# Altium project Kicker_Altium.PrjPcb
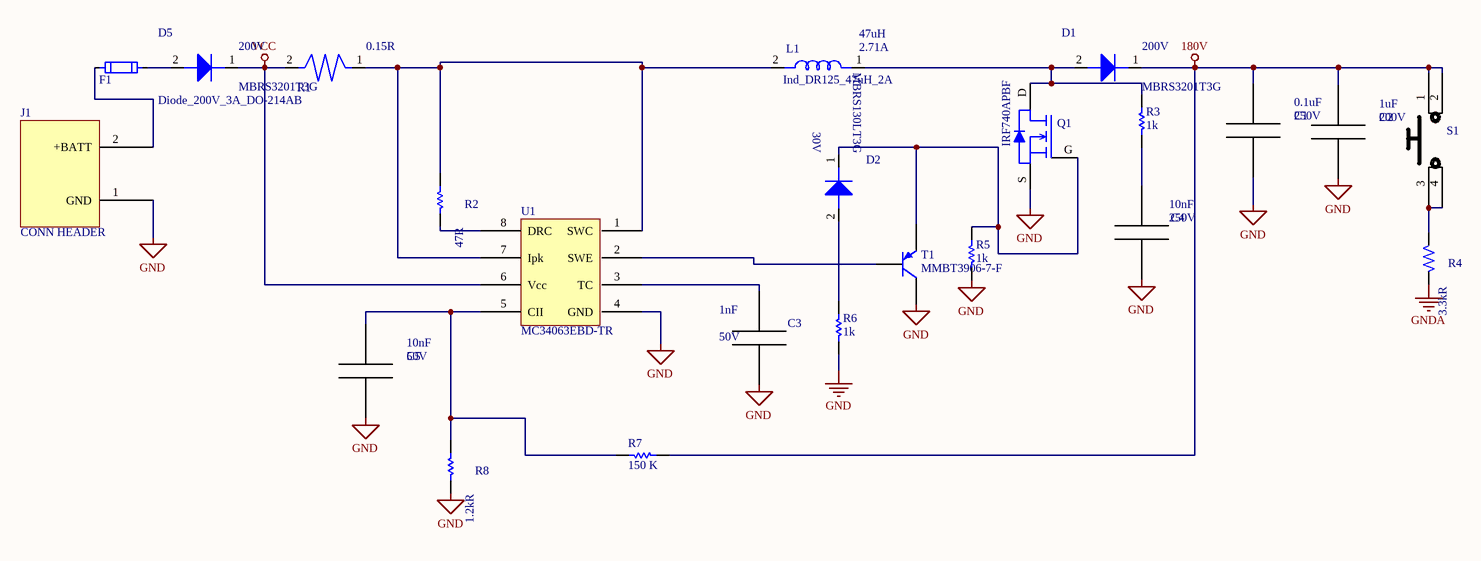
[diagram p0: Sheet2.SchDoc]
1 sheet, 23 parts. Net scope: global (net labels, ports and power ports of the same name join across sheets).
Board file: Kicker.PcbDoc

## Sheet Sheet2.SchDoc
size A4

### Parts
C1  Cap_Cer_0.1u_250V_1206  [CAP_CER_0.1U_250V_1206]  (value not drawn)
C2  Cap_Cer_1u_200V_2225  [Cap_Cer_1u_200V_2225]  (value not drawn)
C3  Cap_Cer_1n_50V_0603  [Cap_Cer 1n_50V_0603]  (value not drawn)
C4  Cap_Cer_10nF_250V_0805  [CAP_CER_10N_250V_0805]  (value not drawn)
C5  Cap_Cer_10n_50V_0603  [Cap_Cer_10n_50V_0603]  (value not drawn)
D1  Diode_200V_3A_DO-214AB  [D320]  (value not drawn)
D2  Diode_30V_2A_DO_214AA  [D130]  (value not drawn)
D5  Diode_200V_3A_DO-214AB  [D320]
F1  Fuseholder(Cartridge)  [FuseHolder]  (value not drawn)
J1  CONN HEADER  [CONN HEADER R_A 2POS 2.54MM]
L1  Ind_DR125_47uH_2A  [DR125]
Q1  IRF740APBF  [To-220]
R1  RES_0.15R_2W_2512  [R2512]  (value not drawn)
R2  Res_47R_0805  [0805]  (value not drawn)
R3  1k  [Resistor_0805]
R4  3.3K OHMS 2512  [RESISTOR_2512]  (value not drawn)
R5  1k  [Resistor_0805]
R6  1k  [Resistor_0805]
R7  150 K  [Resistor_0805]
R8  Res_1.2K_0805_1%  [0805]  (value not drawn)
S1  B3F-1005  [SWITCH_TACTILE_SPST-NO_0.05A_24V]  (value not drawn)
T1  MMBT3906-7-F  [SOT-23-3]
U1  MC34063EBD-TR  [MC34063EBD-TR]

### Nets
180V: C1.1 C2.1 D1.1 R7.1 S1.1 S1.2
GND: C1.2 C2.2 C3.2 C4.2 C5.2 J1.1(GND) Q1.S R5.1 R6.1 R8.1 T1.C U1.4(GND)
GNDA: R4.2
VCC: D5.1 R1.2 U1.6(Vcc)
NetC3_1: C3.1 U1.3(TC)
NetC4_1: C4.1 R3.1
NetC5_1: C5.1 R7.2 R8.2 U1.5(CII)
NetD1_2: D1.2 L1.1 Q1.D R3.2
NetD2_1: D2.1 Q1.G R5.2 T1.E
NetD2_2: D2.2 R6.2
NetD5_2: D5.2 F1.1
NetF1_2: F1.2 J1.2(+BATT)
NetL1_2: L1.2 R1.1 R2.2 U1.1(SWC) U1.7(Ipk)
NetR2_1: R2.1 U1.8(DRC)
NetR4_1: R4.1 S1.3 S1.4
NetT1_B: T1.B U1.2(SWE)

### Notes on the sheet
- (in symbol Cap_Cer_0.1u_250V_1206) 0.1uF
- (in symbol RES_0.15R_2W_2512) 0.15R

### Library data of the parts
C1 = Cap_Cer_0.1u_250V_1206: KEMET - C1206C104KARACTU - CAP, 0.1µF, 250V, 10%, X7R, 1206; Dielectric Material: Ceramic; Capacitance: 100nF; Dissipation Factor: 2.5%; Supplier 1: Digi-Key; Manufacturer: KEMET; Manufacturer Part Number: C1206C104KARACTU; RoHS: Yes; Category: Ceramic Capacitors; Stock 1: 71903; Pricing 1: 1=0,40000, 10=0,27700, 100=0,16620, 500=0,12466, 1000=0,10527 (USD); Mount: Surface Mount,PCB; Case/Package: 1206; Number of Pins: 2; Case Code (Metric): 3216; Case Code (Imperial): 1206; Contact Plating: Tin,Matte; Min Operating Temperature: -55°C; Max Operating Temperature: 125°C; Package Quantity: 2500; Voltage Rating: 250V; Tolerance: 10%; Packaging: Tape and Reel; Voltage Rating (DC): 250V; Dielectric: X7R; Termination: SMD/SMT; Voltage: 250V; Length: 3.2mm; Height: 1.25mm; Width: 0.063inch; Thickness: 0.055inch; Depth: 1.6mm; Radiation Hardening: No; REACH SVHC: No SVHC; ComponentLink1URL: https://datasheet.ciiva.com/146/kem-c1002-x7r-smd-146896.pdf?src-supplier=Digi-Key; ComponentLink1Description: https://datasheet.ciiva.com/146/kem-c1002-x7r-smd-146896.pdf?src-supplier=Digi-Key; ComponentLink2URL: https://datasheet.ciiva.com/146/kem-c1002-x7r-smd-146897.pdf?src-supplier=Digi-Key; ComponentLink2Description: https://datasheet.ciiva.com/146/kem-c1002-x7r-smd-146897.pdf?src-supplier=Digi-Key; ComponentLink3URL: https://datasheet.ciiva.com/146/kem-c1002-x7r-smd-146898.pdf?src-supplier=Digi-Key; ComponentLink3Description: https://datasheet.ciiva.com/146/kem-c1002-x7r-smd-146898.pdf?src-supplier=Digi-Key; ComponentLink4URL: https://datasheet.ciiva.com/28533/1918693-28533237.pdf?src-supplier=Element14; ComponentLink4Description: https://datasheet.ciiva.com/28533/1918693-28533237.pdf?src-supplier=Element14; ComponentLink5URL: https://datasheet.ciiva.com/14588/70096117-14588278.pdf?src-supplier=Allied+Electronics; ComponentLink5Description: https://datasheet.ciiva.com/14588/70096117-14588278.pdf?src-supplier=Allied+Electronics; ComponentLink6URL: https://datasheet.ciiva.com/6094/kem-c1002-x7r-smd-6094138.pdf?src-supplier=Farnell; ComponentLink6Description: https://datasheet.ciiva.com/6094/kem-c1002-x7r-smd-6094138.pdf?src-supplier=Farnell
C2 = Cap_Cer_1u_200V_2225: CAP CER 1UF 200V X7R 2225; Manufacturer: Vishay Vitramon; Manufacturer Part Number: VJ2225Y105KXCAT; Tolerance: 10%; Supplier 1: Digi-Key; RoHS: Yes; Category: Ceramic Capacitors; Stock 1: 12164; Pricing 1: 1=2,15000, 10=1,74000, 100=1,32860 (USD); Mount: Surface Mount; Case/Package: 2225; Case Code (Metric): 5763; Case Code (Imperial): 2225; Min Operating Temperature: -55°C; Max Operating Temperature: 125°C; Capacitance: 1uF; Voltage Rating (DC): 200V; Dielectric: X7R; Packaging: Tape and Reel; Termination: SMD/SMT; Package Quantity: 1; Voltage Rating: 200V; Length: 5.59mm; Height: 2.18mm; Width: 0.25inch; Thickness: 0.086inch; Depth: 6.35mm; Radiation Hardening: No; Lead Free: Lead Free; ComponentLink1URL: https://datasheet.ciiva.com/149/vjcommercialseries-149648.pdf?src-supplier=Digi-Key; ComponentLink1Description: https://datasheet.ciiva.com/149/vjcommercialseries-149648.pdf?src-supplier=Digi-Key; ComponentLink2URL: https://datasheet.ciiva.com/149/vjcommercialseries-149649.pdf?src-supplier=Digi-Key; ComponentLink2Description: https://datasheet.ciiva.com/149/vjcommercialseries-149649.pdf?src-supplier=Digi-Key; ComponentLink3URL: https://datasheet.ciiva.com/15165/getdatasheetpartid-44670-15165222.pdf?src-supplier=Verical; ComponentLink3Description: https://datasheet.ciiva.com/15165/getdatasheetpartid-44670-15165222.pdf?src-supplier=Verical; ComponentLink4URL: https://datasheet.ciiva.com/149/vjcommercialseries-149647.pdf?src-supplier=Digi-Key; ComponentLink4Description: https://datasheet.ciiva.com/149/vjcommercialseries-149647.pdf?src-supplier=Digi-Key
C3 = Cap_Cer_1n_50V_0603: MURATA - GRM188R71H102KA01D - CAP, MLCC, X7R, 1NF, 50V, 0603, REEL; Dielectric Material: Ceramic; Tolerance: 10%; Insulation Resistance: 10GR; Supplier 1: Future Electronics; Manufacturer: Murata; Manufacturer Part Number: GRM188R71H102KA01D; RoHS: Yes; Category: Ceramic Capacitors; Stock 1: 2496000; Pricing 1: 4000=0,00310 (USD); Mount: Surface Mount; Case/Package: 0603; Number of Pins: 2; Material: Ceramic; Case Code (Metric): 1608; Case Code (Imperial): 0603; Min Operating Temperature: -55°C; Max Operating Temperature: 125°C; Dielectric: X7R; Capacitance: 1nF; Voltage Rating (DC): 50V; Packaging: Tape and Reel; Package Quantity: 1; Termination: SMD/SMT; Voltage: 50V; Voltage Rating: 50V; Length: 1.6mm; Height: 0.8mm; Width: 0.031inch; Thickness: 0.035inch; Depth: 0.8mm; REACH SVHC: No SVHC; Lead Free: Lead Free; ComponentLink1URL: https://datasheet.ciiva.com/19476/1857575-19476358.pdf?src-supplier=Jameco; ComponentLink1Description: https://datasheet.ciiva.com/19476/1857575-19476358.pdf?src-supplier=Jameco; ComponentLink2URL: https://datasheet.ciiva.com/29202/451684-da-01-en-vs-kondensator-0603-29202035.pdf?src-supplier=Conrad; ComponentLink2Description: https://datasheet.ciiva.com/29202/451684-da-01-en-vs-kondensator-0603-29202035.pdf?src-supplier=Conrad; ComponentLink3URL: https://datasheet.ciiva.com/14116/grmseries-highdielectrictype-eng-14116630.pdf?src-supplier=Distrelec; ComponentLink3Description: https://datasheet.ciiva.com/14116/grmseries-highdielectrictype-eng-14116630.pdf?src-supplier=Distrelec; ComponentLink4URL: https://datasheet.ciiva.com/16311/product-16311526.pdf?src-supplier=Future+Electronics; ComponentLink4Description: https://datasheet.ciiva.com/16311/product-16311526.pdf?src-supplier=Future+Electronics; ComponentLink5URL: https://datasheet.ciiva.com/129/partnumbering-e-01-129816.pdf?src-supplier=Digi-Key; ComponentLink5Description: https://datasheet.ciiva.com/129/partnumbering-e-01-129816.pdf?src-supplier=Digi-Key; ComponentLink6URL: https://datasheet.ciiva.com/129/partnumbering-e-01-129817.pdf?src-supplier=Digi-Key; ComponentLink6Description: https://datasheet.ciiva.com/129/partnumbering-e-01-129817.pdf?src-supplier=Digi-Key; ComponentLink7URL: https://datasheet.ciiva.com/129/partnumbering-e-01-129818.pdf?src-supplier=Digi-Key; ComponentLink7Description: https://datasheet.ciiva.com/129/partnumbering-e-01-129818.pdf?src-supplier=Digi-Key; ComponentLink8URL: https://datasheet.ciiva.com/5424/product-5424794.pdf?src-supplier=Mouser; ComponentLink8Description: https://datasheet.ciiva.com/5424/product-5424794.pdf?src-supplier=Mouser; ComponentLink9URL: https://datasheet.ciiva.com/28534/1769893-28534220.pdf?src-supplier=Element14; ComponentLink9Description: https://datasheet.ciiva.com/28534/1769893-28534220.pdf?src-supplier=Element14; ComponentLink10URL: https://datasheet.ciiva.com/46441/4360-46441324.pdf?src-supplier=Element14; ComponentLink10Description: https://datasheet.ciiva.com/46441/4360-46441324.pdf?src-supplier=Element14; ComponentLink11URL: https://datasheet.ciiva.com/48428/nmgrm-data-en-48428588.pdf?src-supplier=Distrelec; ComponentLink11Description: https://datasheet.ciiva.com/48428/nmgrm-data-en-48428588.pdf?src-supplier=Distrelec; ComponentLink12URL: https://datasheet.ciiva.com/7937/1784410-7937653.pdf?src-supplier=Element14; ComponentLink12Description: https://datasheet.ciiva.com/7937/1784410-7937653.pdf?src-supplier=Element14; ComponentLink13URL: https://datasheet.ciiva.com/48428/nmgrm-data-en-48428589.pdf?src-supplier=Distrelec; ComponentLink13Description: https://datasheet.ciiva.com/48428/nmgrm-data-en-48428589.pdf?src-supplier=Distrelec
C4 = Cap_Cer_10nF_250V_0805: Capacitors; Ceramic SMT; Tip and Ring; .010uF 250V; 10%; X7R; TR; Manufacturer: KEMET; Manufacturer Part Number: C0805C103KARACTU; Capacitance: 10nF; Supplier 1: Digi-Key; RoHS: Yes; Category: Ceramic Capacitors; Stock 1: 136764; Pricing 1: 1=0,20000, 10=0,13900, 100=0,07020, 500=0,04802, 1000=0,04248 (USD); Mount: Surface Mount,PCB; Case/Package: 0805; Number of Pins: 2; Case Code (Metric): 2012; Case Code (Imperial): 0805; Contact Plating: Tin,Matte; Dielectric Material: Ceramic; Min Operating Temperature: -55°C; Max Operating Temperature: 125°C; Tolerance: 10%; Package Quantity: 1; Voltage Rating: 250V; Packaging: Tape and Reel; Voltage Rating (DC): 250V; Dielectric: X7R; Termination: SMD/SMT; Voltage: 250V; Dissipation Factor: 10%; Length: 2mm; Height: 0.78mm; Width: 0.049inch; Thickness: 0.035inch; Lead Pitch: 0.75mm; Depth: 1.2mm; Radiation Hardening: No; REACH SVHC: No SVHC; ComponentLink1URL: https://datasheet.ciiva.com/26923/getdatasheetpartid-151914-26923959.pdf?src-supplier=Verical; ComponentLink1Description: https://datasheet.ciiva.com/26923/getdatasheetpartid-151914-26923959.pdf?src-supplier=Verical; ComponentLink2URL: https://datasheet.ciiva.com/145/kem-c1002-x7r-smd-145393.pdf?src-supplier=Digi-Key; ComponentLink2Description: https://datasheet.ciiva.com/145/kem-c1002-x7r-smd-145393.pdf?src-supplier=Digi-Key; ComponentLink3URL: https://datasheet.ciiva.com/145/kem-c1002-x7r-smd-145394.pdf?src-supplier=Digi-Key; ComponentLink3Description: https://datasheet.ciiva.com/145/kem-c1002-x7r-smd-145394.pdf?src-supplier=Digi-Key; ComponentLink4URL: https://datasheet.ciiva.com/145/kem-c1002-x7r-smd-145395.pdf?src-supplier=Digi-Key; ComponentLink4Description: https://datasheet.ciiva.com/145/kem-c1002-x7r-smd-145395.pdf?src-supplier=Digi-Key; ComponentLink5URL: https://datasheet.ciiva.com/22700/1851736-22700520.pdf?src-supplier=Element14; ComponentLink5Description: https://datasheet.ciiva.com/22700/1851736-22700520.pdf?src-supplier=Element14
C5 = Cap_Cer_10n_50V_0603: Capacitor 10 nF 50 VDC 0603 | Murata GRM188R71H103KA01D (Capacitor 10 nF 50 VDC 0603 Ceramic Capacitors).; Capacitance: 10nF; Tolerance: 10%; Dielectric: X7R; Voltage: 50V; Insulation Resistance: 10GR; Supplier 1: Arrow; Manufacturer: Murata; Manufacturer Part Number: GRM188R71H103KA01D; RoHS: Yes; Category: Ceramic Capacitors; Stock 1: 472000; Pricing 1: 4000=0,01810, 8000=0,01790, 24000=0,01540, 100000=0,01510 (USD); Mount: Surface Mount; Case/Package: 0603; Number of Pins: 2; Material: Ceramic; Case Code (Metric): 1608; Case Code (Imperial): 0603; Dielectric Material: Ceramic; Min Operating Temperature: -55°C; Max Operating Temperature: 125°C; Termination: SMD/SMT; Package Quantity: 1; Voltage Rating: 50V; Packaging: Tape and Reel; Voltage Rating (DC): 50V; Length: 1.6mm; Height: 0.8mm; Thickness: 0.035inch; Depth: 0.8mm; Width: 0.031inch; Lead Free: Lead Free; REACH SVHC: Unknown; ComponentLink1URL: https://datasheet.ciiva.com/129/product-129872.pdf?src-supplier=Digi-Key; ComponentLink1Description: https://datasheet.ciiva.com/129/product-129872.pdf?src-supplier=Digi-Key; ComponentLink2URL: https://datasheet.ciiva.com/11786/0900766b8003061f-11786516.pdf?src-supplier=RSComponents; ComponentLink2Description: https://datasheet.ciiva.com/11786/0900766b8003061f-11786516.pdf?src-supplier=RSComponents; ComponentLink3URL: https://datasheet.ciiva.com/29202/451715-da-01-en-vs-kondensator-0603-29202047.pdf?src-supplier=Conrad; ComponentLink3Description: https://datasheet.ciiva.com/29202/451715-da-01-en-vs-kondensator-0603-29202047.pdf?src-supplier=Conrad; ComponentLink4URL: https://datasheet.ciiva.com/129/partnumbering-e-01-129870.pdf?src-supplier=Digi-Key; ComponentLink4Description: https://datasheet.ciiva.com/129/partnumbering-e-01-129870.pdf?src-supplier=Digi-Key; ComponentLink5URL: https://datasheet.ciiva.com/48428/nmgrm-data-en-48428590.pdf?src-supplier=Distrelec; ComponentLink5Description: https://datasheet.ciiva.com/48428/nmgrm-data-en-48428590.pdf?src-supplier=Distrelec; ComponentLink6URL: https://datasheet.ciiva.com/129/partnumbering-e-01-129871.pdf?src-supplier=Digi-Key; ComponentLink6Description: https://datasheet.ciiva.com/129/partnumbering-e-01-129871.pdf?src-supplier=Digi-Key; ComponentLink7URL: https://datasheet.ciiva.com/48428/nmgrm-data-en-48428591.pdf?src-supplier=Distrelec; ComponentLink7Description: https://datasheet.ciiva.com/48428/nmgrm-data-en-48428591.pdf?src-supplier=Distrelec; ComponentLink8URL: https://datasheet.ciiva.com/7937/4360-7937654.pdf?src-supplier=Element14; ComponentLink8Description: https://datasheet.ciiva.com/7937/4360-7937654.pdf?src-supplier=Element14; ComponentLink9URL: https://datasheet.ciiva.com/7937/1747461-7937655.pdf?src-supplier=Element14; ComponentLink9Description: https://datasheet.ciiva.com/7937/1747461-7937655.pdf?src-supplier=Element14; ComponentLink10URL: https://datasheet.ciiva.com/7937/1747461-7937656.pdf?src-supplier=Element14; ComponentLink10Description: https://datasheet.ciiva.com/7937/1747461-7937656.pdf?src-supplier=Element14; ComponentLink11URL: https://datasheet.ciiva.com/28534/1769893-28534235.pdf?src-supplier=Element14; ComponentLink11Description: https://datasheet.ciiva.com/28534/1769893-28534235.pdf?src-supplier=Element14
D1 D5 = Diode_200V_3A_DO-214AB: ON SEMICONDUCTOR - MBRS3201T3G - Schottky Rectifier, 200 V, 3 A, Single, DO-214AB (SMC), 2 Pins, 840 mV; Peak Reverse Current: 5uA; Max Surge Current: 100A; Forward Voltage: 840mV; Forward Current: 3A; Recovery Time: 35ns; Max Repetitive Reverse Voltage (Vrrm): 200V; Polarity: Standard; Supplier 1: Digi-Key; Manufacturer: ON Semiconductor; Manufacturer Part Number: MBRS3201T3G; RoHS: Yes; Category: Schottky Diodes; Stock 1: 6509; Pricing 1: 1=0,60000, 10=0,53200, 25=0,49960, 100=0,36270, 250=0,34980, 500=0,30306, 1000=0,25792 (USD); Case/Package: SMC; Number of Pins: 2; Contact Plating: Tin,Matte; Min Operating Temperature: -55°C; Max Operating Temperature: 150°C; Package Quantity: 2500; Packaging: Tape and Reel; Average Rectified Current: 3A; Reverse Recovery Time: 35ns; Max Reverse Leakage Current: 5uA; Peak Non-Repetitive Surge Current: 100A; Max Forward Surge Current (Ifsm): 100A; Element Configuration: Single; Voltage Rating (DC): 200V; Current Rating: 3A; Output Current: 3A; Max Reverse Voltage (DC): 200V; Length: 7.11mm; Height: 2.26mm; Width: 6.1mm; Radiation Hardening: No; REACH SVHC: No SVHC; Lead Free: Lead Free; Halogen Free: Halogen Free; ComponentLink1URL: https://datasheet.ciiva.com/923/mbrs3201t3-d-923290.pdf?src-supplier=Avnet; ComponentLink1Description: https://datasheet.ciiva.com/923/mbrs3201t3-d-923290.pdf?src-supplier=Avnet; ComponentLink2URL: https://datasheet.ciiva.com/22659/1708281-22659072.pdf?src-supplier=Element14; ComponentLink2Description: https://datasheet.ciiva.com/22659/1708281-22659072.pdf?src-supplier=Element14; ComponentLink3URL: https://datasheet.ciiva.com/916/mbrs3201t3-916256.pdf?src-supplier=Digi-Key; ComponentLink3Description: https://datasheet.ciiva.com/916/mbrs3201t3-916256.pdf?src-supplier=Digi-Key; ComponentLink4URL: https://datasheet.ciiva.com/26912/getdatasheetpartid-105192-26912741.pdf?src-supplier=Verical; ComponentLink4Description: https://datasheet.ciiva.com/26912/getdatasheetpartid-105192-26912741.pdf?src-supplier=Verical; ComponentLink5URL: https://datasheet.ciiva.com/25948/mbrs3201t3-d-25948165.pdf?src-supplier=Avnet+Europe; ComponentLink5Description: https://datasheet.ciiva.com/25948/mbrs3201t3-d-25948165.pdf?src-supplier=Avnet+Europe; ComponentLink6URL: https://datasheet.ciiva.com/8294/mbrs3201t3-d-8294973.pdf?src-supplier=Avnet; ComponentLink6Description: https://datasheet.ciiva.com/8294/mbrs3201t3-d-8294973.pdf?src-supplier=Avnet; ComponentLink7URL: https://datasheet.ciiva.com/916/mbrs3201t3-d-916255.pdf?src-supplier=Digi-Key; ComponentLink7Description: https://datasheet.ciiva.com/916/mbrs3201t3-d-916255.pdf?src-supplier=Digi-Key; ComponentLink8URL: https://datasheet.ciiva.com/916/mbrs3201t3-d-916257.pdf?src-supplier=Digi-Key; ComponentLink8Description: https://datasheet.ciiva.com/916/mbrs3201t3-d-916257.pdf?src-supplier=Digi-Key; ComponentLink9URL: https://datasheet.ciiva.com/16393/mbrs3201t3-d-16393647.pdf?src-supplier=Future+Electronics; ComponentLink9Description: https://datasheet.ciiva.com/16393/mbrs3201t3-d-16393647.pdf?src-supplier=Future+Electronics; Supplier Part Number 1: MBRS3201T3GOSCT-ND
D2 = Diode_30V_2A_DO_214AA: ON SEMICONDUCTOR - MBRS130LT3G - Rectifier Diode, Single, 30 V, 2 A, DO-214AA, 2, 395 mV RoHS Compliant: Yes; Max Surge Current: 40A; Forward Voltage: 395mV; Forward Current: 2A; Peak Reverse Current: 1mA; Max Repetitive Reverse Voltage (Vrrm): 30V; Polarity: Standard; Current Rating: 1A; Manufacturer: ON Semiconductor; Manufacturer Part Number: MBRS130LT3G; RoHS: Yes; Pricing 1: 1=0,47000, 10=0,34900, 25=0,30520, 100=0,16570, 250=0,16480, 500=0,13516, 1000=0,10028 (USD); Case/Package: SMB; Number of Pins: 2; Contact Plating: Tin,Matte; Min Operating Temperature: -65°C; Max Operating Temperature: 125°C; Package Quantity: 1; Packaging: Tape and Reel; Average Rectified Current: 2A; Max Reverse Leakage Current: 1mA; Max Forward Surge Current (Ifsm): 40A; Termination: SMD/SMT; Peak Non-Repetitive Surge Current: 40A; Element Configuration: Single; Voltage Rating (DC): 30V; Output Current: 1A; Max Reverse Voltage (DC): 30V; Length: 0.181inch; Height: 0.09inch; Width: 0.156inch; Radiation Hardening: No; REACH SVHC: No SVHC; Lead Free: Lead Free; Halogen Free: Halogen Free; ComponentLink1URL: https://datasheet.ciiva.com/5763/mbrs130lt3-d-5763008.pdf?src-supplier=Farnell; ComponentLink1Description: https://datasheet.ciiva.com/5763/mbrs130lt3-d-5763008.pdf?src-supplier=Farnell; ComponentLink2URL: https://datasheet.ciiva.com/915/mbrs130lt3-d-915698.pdf?src-supplier=Digi-Key; ComponentLink2Description: https://datasheet.ciiva.com/915/mbrs130lt3-d-915698.pdf?src-supplier=Digi-Key; ComponentLink3URL: https://datasheet.ciiva.com/27050/865899-27050530.pdf?src-supplier=Jameco; ComponentLink3Description: https://datasheet.ciiva.com/27050/865899-27050530.pdf?src-supplier=Jameco; ComponentLink4URL: https://datasheet.ciiva.com/22659/1708275-22659062.pdf?src-supplier=Element14; ComponentLink4Description: https://datasheet.ciiva.com/22659/1708275-22659062.pdf?src-supplier=Element14; ComponentLink5URL: https://datasheet.ciiva.com/915/mbrs130lt3-d-915699.pdf?src-supplier=Digi-Key; ComponentLink5Description: https://datasheet.ciiva.com/915/mbrs130lt3-d-915699.pdf?src-supplier=Digi-Key; ComponentLink6URL: https://datasheet.ciiva.com/915/mbrs130lt3-d-915700.pdf?src-supplier=Digi-Key; ComponentLink6Description: https://datasheet.ciiva.com/915/mbrs130lt3-d-915700.pdf?src-supplier=Digi-Key; ComponentLink7URL: https://datasheet.ciiva.com/7962/mbrs130lt3-d-7962810.pdf?src-supplier=Element14; ComponentLink7Description: https://datasheet.ciiva.com/7962/mbrs130lt3-d-7962810.pdf?src-supplier=Element14; ComponentLink8URL: https://datasheet.ciiva.com/25950/mbrs130lt3-d-25950250.pdf?src-supplier=Avnet+Europe; ComponentLink8Description: https://datasheet.ciiva.com/25950/mbrs130lt3-d-25950250.pdf?src-supplier=Avnet+Europe; ComponentLink9URL: https://datasheet.ciiva.com/16363/mbrs130lt3-d-16363355.pdf?src-supplier=Future+Electronics; ComponentLink9Description: https://datasheet.ciiva.com/16363/mbrs130lt3-d-16363355.pdf?src-supplier=Future+Electronics; Supplier 1: Digi-Key; Category: Schottky Diodes; Supplier Part Number 1: MBRS130LT3GOSCT-ND
F1 = Fuseholder(Cartridge): Fuse Holder 10A 500VDC Solder Pin Through Hole Bulk Cartridge; Manufacturer: Schurter; Manufacturer Part Number: 00318201; Body Material: Thermoplastic; Material: Thermoplastic,Tin; Color: Black; Illumination Type: Illuminated; Number of Circuits: 1; Voltage: 500V; Insulation Resistance: 10MR; Voltage Rating: 250V; Approvals: UL,CSA,IEC,EN; Supplier 1: Digi-Key; RoHS: Yes; Category: Fuses; Stock 1: 26932; Pricing 1: 1=0,91000, 50=0,67600, 100=0,60800, 500=0,45900, 1000=0,34080 (USD); Mount: PCB,Through Hole; Weight: 0.059966oz; Contact Plating: Tin; Contact Material: Copper Alloy,Tin; Min Operating Temperature: -40°C; Max Operating Temperature: 85°C; Packaging: Bulk; Orientation: Horizontal; Termination: PC Pin; Fuse Current: 10A; Current Rating: 10A; Number of Poles: 1; Package Quantity: 100; Voltage Rating (DC): 500V; Voltage Rating (AC): 500V; Length: 25mm; Depth: 10.8mm; Radiation Hardening: No; Lead Free: Lead Free; REACH SVHC: No SVHC; Flammability Rating: UL94 V-0; ComponentLink1URL: https://datasheet.ciiva.com/3014/typ-ogn-3014480.pdf?src-supplier=Avnet; ComponentLink1Description: https://datasheet.ciiva.com/3014/typ-ogn-3014480.pdf?src-supplier=Avnet; ComponentLink2URL: https://datasheet.ciiva.com/3014/typ-ogn-3014480.pdf?src-supplier=Mouser; ComponentLink2Description: https://datasheet.ciiva.com/3014/typ-ogn-3014480.pdf?src-supplier=Mouser; ComponentLink3URL: https://datasheet.ciiva.com/16215/typ-ogn-16215099.pdf?src-supplier=Onlinecomponents.com; ComponentLink3Description: https://datasheet.ciiva.com/16215/typ-ogn-16215099.pdf?src-supplier=Onlinecomponents.com; ComponentLink4URL: https://datasheet.ciiva.com/1269/1842496-1269251.pdf?src-supplier=Element14; ComponentLink4Description: https://datasheet.ciiva.com/1269/1842496-1269251.pdf?src-supplier=Element14; ComponentLink5URL: https://datasheet.ciiva.com/16203/typ-ogn-16203626.pdf?src-supplier=Future+Electronics; ComponentLink5Description: https://datasheet.ciiva.com/16203/typ-ogn-16203626.pdf?src-supplier=Future+Electronics; ComponentLink6URL: https://datasheet.ciiva.com/16463/typ-ogn-16463850.pdf?src-supplier=Avnet+Asia; ComponentLink6Description: https://datasheet.ciiva.com/16463/typ-ogn-16463850.pdf?src-supplier=Avnet+Asia; ComponentLink7URL: https://datasheet.ciiva.com/25893/typ-ogn-25893934.pdf?src-supplier=Avnet+Europe; ComponentLink7Description: https://datasheet.ciiva.com/25893/typ-ogn-25893934.pdf?src-supplier=Avnet+Europe; ComponentLink8URL: https://datasheet.ciiva.com/15188/getdatasheetpartid-392104-15188042.pdf?src-supplier=Verical; ComponentLink8Description: https://datasheet.ciiva.com/15188/getdatasheetpartid-392104-15188042.pdf?src-supplier=Verical
J1 = CONN HEADER R_A 2POS 2.54MM: Conn Wire to Board HDR 2 POS 2.54mm Solder RA Thru-Hole Bag; Manufacturer 1: Molex; Gender: Male; Number of Circuits: 2; Contact Resistance: 10mR; Max Current Rating: 4A; Max Voltage Rating (AC): 250V; Glow Wire Compliant: Non-compliant; Approvals: UL,CSA; Supplier 1: Digi-Key; Manufacturer Part Number 1: 22-05-3021; Stock 1: 15372; Pricing 1: 1=0,34000, 10=0,31700, 100=0,22200, 500=0,19026, 1000=0,15855, 5000=0,13590, 10000=0,12684 (USD); RoHS: Yes; Mount: Through Hole; Housing Color: White; Housing Material: Nylon; Contact Material: Brass; Contact Plating: Tin,Copper; Color: White; Min Operating Temperature: 0°C; Max Operating Temperature: 75°C; Orientation: Right Angle; Number of Positions: 2; Termination: Through Hole; Number of Rows: 1; Number of Contacts: 2; Voltage Rating: 250V; Current Rating: 4A; Packaging: Bulk; Package Quantity: 3000; Length: 5.08mm; Height: 6.35mm; Pitch: 2.54mm; Depth: 12.83mm; Radiation Hardening: No; REACH SVHC: Unknown; Halogen Free: Low Halogen; Lead Free: Lead Free; Flammability Rating: UL94 V-0; ComponentLink1URL: https://datasheet.ciiva.com/30078/51220022053021-pcb-headers-30078128.pdf?src-supplier=Onlinecomponents.com; ComponentLink1Description: https://datasheet.ciiva.com/30078/51220022053021-pcb-headers-30078128.pdf?src-supplier=Onlinecomponents.com; ComponentLink2URL: https://datasheet.ciiva.com/15217/getdatasheetpartid-149585-15217569.pdf?src-supplier=Verical; ComponentLink2Description: https://datasheet.ciiva.com/15217/getdatasheetpartid-149585-15217569.pdf?src-supplier=Verical; ComponentLink3URL: https://datasheet.ciiva.com/11746/0900766b80d8f337-11746227.pdf?src-supplier=RSComponents; ComponentLink3Description: https://datasheet.ciiva.com/11746/0900766b80d8f337-11746227.pdf?src-supplier=RSComponents; ComponentLink4URL: https://datasheet.ciiva.com/19461/1965824-19461009.pdf?src-supplier=Jameco; ComponentLink4Description: https://datasheet.ciiva.com/19461/1965824-19461009.pdf?src-supplier=Jameco; ComponentLink5URL: https://datasheet.ciiva.com/5158/0022053021-pcb-headers-158630-5158265.pdf?src-supplier=Mouser; ComponentLink5Description: https://datasheet.ciiva.com/5158/0022053021-pcb-headers-158630-5158265.pdf?src-supplier=Mouser; ComponentLink6URL: https://datasheet.ciiva.com/19460/233437-19460906.pdf?src-supplier=Jameco; ComponentLink6Description: https://datasheet.ciiva.com/19460/233437-19460906.pdf?src-supplier=Jameco; ComponentLink7URL: https://datasheet.ciiva.com/7920/1631484-7920683.pdf?src-supplier=Element14; ComponentLink7Description: https://datasheet.ciiva.com/7920/1631484-7920683.pdf?src-supplier=Element14; ComponentLink8URL: https://datasheet.ciiva.com/16725/0022053021-pcb-headers-16725597.pdf?src-supplier=Avnet+Europe; ComponentLink8Description: https://datasheet.ciiva.com/16725/0022053021-pcb-headers-16725597.pdf?src-supplier=Avnet+Europe; ComponentLink9URL: https://datasheet.ciiva.com/9468/0022053021-pcb-headers-9468406.pdf?src-supplier=Avnet; ComponentLink9Description: https://datasheet.ciiva.com/9468/0022053021-pcb-headers-9468406.pdf?src-supplier=Avnet; Supplier Part Number 1: 900-0022053021-ND
L1 = Ind_DR125_47uH_2A: FIXED IND 47UH 2.71A 74 MOHM SMD; Manufacturer: Eaton Cooper; Manufacturer Part Number: DR125-470-R; Core Material: Ferrite; Tolerance: 20%; Shielding: Shielded; Saturation Current: 3.24A; DC Resistance (DCR): 74mR; Test Frequency: 100kHz; Supplier 1: Digi-Key; RoHS: Yes; Category: Fixed Inductors; Stock 1: 13528; Pricing 1: 1=1,54000, 10=1,43200, 100=1,03530 (USD); Mount: Surface Mount; Case/Package: Nonstandard; Number of Pins: 2; Weight: 0.144oz; Min Operating Temperature: -40°C; Max Operating Temperature: 125°C; Packaging: Tape and Reel; Inductance Tolerance: 20%; Inductance: 47uH; Current Rating: 2.71A; Max DC Current: 2.71A; Termination: SMD/SMT; Composition: Wirewound; DC Current: 2.71A; Military Standard: Not; Self Resonant Frequency: 100kHz; RMS Current (Irms): 2.71A; Length: 12.5mm; Height: 6mm; Width: 12.5mm; Height - Seated (Max): 0.236inch; Depth: 12.5mm; Radiation Hardening: No; REACH SVHC: No SVHC; ComponentLink1URL: https://datasheet.ciiva.com/14667/0900766b8116a153-14667792.pdf?src-supplier=RSComponents; ComponentLink1Description: https://datasheet.ciiva.com/14667/0900766b8116a153-14667792.pdf?src-supplier=RSComponents; ComponentLink2URL: https://datasheet.ciiva.com/26858/getdatasheetpartid-246997-26858394.pdf?src-supplier=Verical; ComponentLink2Description: https://datasheet.ciiva.com/26858/getdatasheetpartid-246997-26858394.pdf?src-supplier=Verical; ComponentLink3URL: https://datasheet.ciiva.com/16941/70037876-16941158.pdf?src-supplier=Allied+Electronics; ComponentLink3Description: https://datasheet.ciiva.com/16941/70037876-16941158.pdf?src-supplier=Allied+Electronics; ComponentLink4URL: https://datasheet.ciiva.com/30119/43bus-elx-ds-4315-dr-ser-30119639.pdf?src-supplier=Onlinecomponents.com; ComponentLink4Description: https://datasheet.ciiva.com/30119/43bus-elx-ds-4315-dr-ser-30119639.pdf?src-supplier=Onlinecomponents.com; ComponentLink5URL: https://datasheet.ciiva.com/27053/1771683-27053547.pdf?src-supplier=Jameco; ComponentLink5Description: https://datasheet.ciiva.com/27053/1771683-27053547.pdf?src-supplier=Jameco; Supplier Part Number 1: 513-1128-1-ND
Q1 = IRF740APBF: MOSFET, N, 400V, 10A, TO-220; Transistor Polarity:N Channel; Continuous Drain Current Id:10A; Drain Source Voltage Vds:400V; On Resistance Rds(on):550mohm; Rds(on) Test Voltage Vgs:10V; Threshold Voltage Vgs:4V; Power Dissipation ;RoHS Compliant: Yes; Manufacturer: Vishay; Power Dissipation: 125W; Number of Channels: 1; Element Configuration: Single; Rise Time: 35ns; Input Capacitance: 1.03nF; Drain to Source Resistance: 550mR; Gate to Source Voltage (Vgs): 30V; Fall Time: 22ns; Turn-Off Delay Time: 24ns; Turn-On Delay Time: 10ns; Threshold Voltage: 4V; Supplier 1: Digi-Key; Manufacturer Part Number: IRF740APBF; RoHS: Yes; Category: MOSFETs; Stock 1: 877; Pricing 1: 1=2,39000, 10=2,14900, 25=2,02760, 100=1,58160, 250=1,54108, 500=1,33832, 1000=1,13554, 2500=1,11932, 5000=1,03821 (USD); Mount: Through Hole; Case/Package: TO-220AB; Number of Pins: 3; Weight: 0.211644oz; Min Operating Temperature: -55°C; Max Operating Temperature: 150°C; Voltage Rating (DC): 400V; Drain to Source Breakdown Voltage: 400V; Current Rating: 10A; Packaging: Rail/Tube; Continuous Drain Current (ID): 10A; Package Quantity: 50; Number of Elements: 1; Max Power Dissipation: 125W; Drain to Source Voltage (Vdss): 400V; Rds On Max: 550mR; On-State Resistance: 550mR; Nominal Vgs: 4V; Length: 10.41mm; Height: 9.01mm; Width: 4.7mm; Radiation Hardening: No; Lead Free: Lead Free; REACH SVHC: No SVHC; ComponentLink1URL: https://datasheet.ciiva.com/15137/getdatasheetpartid-70588-15137354.pdf?src-supplier=Verical; ComponentLink1Description: https://datasheet.ciiva.com/15137/getdatasheetpartid-70588-15137354.pdf?src-supplier=Verical; ComponentLink2URL: https://datasheet.ciiva.com/4440/91051-69767-4440212.pdf?src-supplier=Mouser; ComponentLink2Description: https://datasheet.ciiva.com/4440/91051-69767-4440212.pdf?src-supplier=Mouser; ComponentLink3URL: https://datasheet.ciiva.com/22754/1349041-22754456.pdf?src-supplier=Farnell; ComponentLink3Description: https://datasheet.ciiva.com/22754/1349041-22754456.pdf?src-supplier=Farnell; ComponentLink4URL: https://datasheet.ciiva.com/16990/0900766b80791156-16990490.pdf?src-supplier=Allied+Electronics; ComponentLink4Description: https://datasheet.ciiva.com/16990/0900766b80791156-16990490.pdf?src-supplier=Allied+Electronics; ComponentLink5URL: https://datasheet.ciiva.com/6385/91051-6385820.pdf?src-supplier=Digi-Key; ComponentLink5Description: https://datasheet.ciiva.com/6385/91051-6385820.pdf?src-supplier=Digi-Key; ComponentLink6URL: https://datasheet.ciiva.com/26146/91051-26146764.pdf?src-supplier=Avnet+Europe; ComponentLink6Description: https://datasheet.ciiva.com/26146/91051-26146764.pdf?src-supplier=Avnet+Europe; ComponentLink7URL: https://datasheet.ciiva.com/11158/91051-11158317.pdf?src-supplier=Avnet; ComponentLink7Description: https://datasheet.ciiva.com/11158/91051-11158317.pdf?src-supplier=Avnet; ComponentLink8URL: https://datasheet.ciiva.com/8025/1916224-8025495.pdf?src-supplier=Element14; ComponentLink8Description: https://datasheet.ciiva.com/8025/1916224-8025495.pdf?src-supplier=Element14; ComponentLink9URL: https://datasheet.ciiva.com/7788/1349041-7788925.pdf?src-supplier=Element14; ComponentLink9Description: https://datasheet.ciiva.com/7788/1349041-7788925.pdf?src-supplier=Element14
R1 = RES_0.15R_2W_2512: TE CONNECTIVITY         RLP73K3AR15JTE             SMD Current Sense Resistor, 0.15 ohm, 2512 [6432 Metric], 2 W,  5%, RL73 Series; Number of Resistors: 1; Power Rating: 2W; Temperature Coefficient: 200ppm/°C; Resistance: 150mR; Manufacturer: TE Connectivity; Manufacturer Part Number: RLP73K3AR15JTE; RoHS: Yes; Stock 1: 4167; Pricing 1: 1=0,63000, 10=0,46300, 25=0,37600, 50=0,32700, 100=0,26980, 250=0,23440, 500=0,19078, 1000=0,15132 (USD); Case/Package: 2512; Case Code (Imperial): 2512; Case Code (Metric): 6432; Min Operating Temperature: -55°C; Max Operating Temperature: 155°C; Termination: Solder; Packaging: Tape and Reel; Composition: Thick Film; Number of Terminations: 2; Tolerance: 5%; Package Quantity: 2000; Max Power Dissipation: 2W; Length: 0.25inch; Height: 0.033inch; Width: 0.124inch; REACH SVHC: No SVHC; ELV: Compliant; ComponentLink1URL: https://datasheet.ciiva.com/18601/eng-cd-2176058-ba-18601048.pdf?src-supplier=Digi-Key; ComponentLink1Description: https://datasheet.ciiva.com/18601/eng-cd-2176058-ba-18601048.pdf?src-supplier=Digi-Key; ComponentLink2URL: https://datasheet.ciiva.com/18601/eng-cd-2176058-ba-18601049.pdf?src-supplier=Digi-Key; ComponentLink2Description: https://datasheet.ciiva.com/18601/eng-cd-2176058-ba-18601049.pdf?src-supplier=Digi-Key; ComponentLink3URL: https://datasheet.ciiva.com/7823/1610602-7823514.pdf?src-supplier=Element14; ComponentLink3Description: https://datasheet.ciiva.com/7823/1610602-7823514.pdf?src-supplier=Element14; ComponentLink4URL: https://datasheet.ciiva.com/18601/eng-cd-2176058-ba-18601050.pdf?src-supplier=Digi-Key; ComponentLink4Description: https://datasheet.ciiva.com/18601/eng-cd-2176058-ba-18601050.pdf?src-supplier=Digi-Key; Supplier 1: Digi-Key; Category: Chip SMD Resistors; Mount: Surface Mount; Supplier Part Number 1: A109895CT-ND
R2 = Res_47R_0805: RES SMD 47 OHM 5% 1/8W 0805; Manufacturer: Stackpole Electronics; Manufacturer Part Number: RMCF0805JT47R0; Max Power Dissipation: 125mW; Temperature Coefficient: 100ppm/°C; Resistance: 47R; Supplier 1: Digi-Key; RoHS: Yes; Category: Chip SMD Resistors; Stock 1: 252315; Pricing 1: 1=0,10000, 10=0,01900, 100=0,00780, 1000=0,00350, 2500=0,00304 (USD); Mount: Surface Mount; Case/Package: 0805; Case Code (Imperial): 0805; Contact Plating: Tin,Matte; Case Code (Metric): 2012; Min Operating Temperature: -55°C; Max Operating Temperature: 155°C; Composition: Thick Film; Number of Terminations: 2; Features: Automotive AEC-Q200; Tolerance: 5%; Power Rating: 125mW; Packaging: Tape and Reel; Length: 0.079inch; Height: 0.026inch; Width: 0.049inch; Radiation Hardening: No; Lead Free: Lead Free; ComponentLink1URL: https://www.seielect.com/catalog/SEI-RMCF_RMCP.pdf?src-supplier=Avnet; ComponentLink1Description: https://www.seielect.com/catalog/SEI-RMCF_RMCP.pdf?src-supplier=Avnet; ComponentLink2URL: http://www.seielect.com/catalog/sei-rmc.pdf?src-supplier=Future+Electronics; ComponentLink2Description: http://www.seielect.com/catalog/sei-rmc.pdf?src-supplier=Future+Electronics; ComponentLink3URL: https://www.seielect.com/Catalog/SEI-RMCF_RMCP.pdf?src-supplier=Digi-Key; ComponentLink3Description: https://www.seielect.com/Catalog/SEI-RMCF_RMCP.pdf?src-supplier=Digi-Key; ComponentLink4URL: https://www.seielect.com/catalog/SEI-Packaging.pdf?src-supplier=Digi-Key; ComponentLink4Description: https://www.seielect.com/catalog/SEI-Packaging.pdf?src-supplier=Digi-Key; ComponentLink5URL: http://components.arrow.com/part/dataview/50576472S7171816N1174?src-supplier=Arrow; ComponentLink5Description: http://components.arrow.com/part/dataview/50576472S7171816N1174?src-supplier=Arrow
R3 R5 R6 = Res_1k_0805: RES SMD 0805 1k 1/8W; Value: RC0805FR-071KL; Supplier 1: Digi-Key; Supplier 2: Mouser; Supplier Part Number 1: 311-1.00KCRDKR-ND; Supplier Part Number 2: 603-RC0805FR-071KL
R4 = RES 3.3K OHM 2512: RES SMD 3.3K OHM 1% 2W 2512; Manufacturer 1: Stackpole Electronics; Manufacturer Part Number 1: RHC2512FT3K30; Temperature Coefficient: 100ppm/°C; Resistance: 3.3kR; Supplier 1: Digi-Key; Stock 1: 1030; Pricing 1: 1=0,84000, 10=0,72600, 100=0,50600, 1000=0,29920 (USD); RoHS: Yes; Mount: Surface Mount; Case/Package: 2512; Case Code (Imperial): 2512; Contact Plating: Tin,Matte; Case Code (Metric): 6432; Min Operating Temperature: -55°C; Max Operating Temperature: 155°C; Max Power Dissipation: 2W; Features: Moisture Resistant; Composition: Thick Film; Number of Terminations: 2; Packaging: Tape and Reel; Tolerance: 1%; Power Rating: 2W; Length: 0.248inch; Height: 0.028inch; Width: 0.126inch; Radiation Hardening: No; Lead Free: Lead Free; ComponentLink1URL: https://www.seielect.com/Catalog/SEI-rhc.pdf?src-supplier=Avnet; ComponentLink1Description: https://www.seielect.com/Catalog/SEI-rhc.pdf?src-supplier=Avnet; ComponentLink2URL: https://www.seielect.com/Catalog/SEI-rhc.pdf?src-supplier=Digi-Key; ComponentLink2Description: https://www.seielect.com/Catalog/SEI-rhc.pdf?src-supplier=Digi-Key; Supplier Part Number 1: RHC2512FT3K30CT-ND
R7 = Res_150k_0805: RES SMD 150K 0.125W 0805; Value: RC0805FR-07220KL; Supplier 1: Digi-Key; Supplier Part Number 1: P150KCCT-ND
R8 = Res_1.2K_0805_1%: PANASONIC ELECTRONIC COMPONENTS - ERJ6ENF1201V - RES, THICK FILM, 1K2, 125MW, 1%, REEL; Manufacturer Part Number: ERJ-6ENF1201V; Resistance: 1.2kR; Temperature Coefficient: 100ppm/°C; Voltage Rating: 150V; Supplier 1: Digi-Key; Manufacturer: Panasonic; RoHS: Yes; Category: Chip SMD Resistors; Stock 1: 22603; Pricing 1: 1=0,10000, 10=0,07200, 100=0,02750, 1000=0,01210, 2500=0,01045 (USD); Mount: Surface Mount; Case/Package: 0805; Contact Plating: Tin; Case Code (Metric): 2012; Case Code (Imperial): 0805; Min Operating Temperature: -55°C; Max Operating Temperature: 155°C; Tolerance: 1%; Composition: Thick Film; Power Rating: 125mW; Packaging: Tape and Reel; Package Quantity: 1; Number of Terminations: 2; Military Standard: Not; Max Power Dissipation: 125mW; Termination: SMD/SMT; Voltage Rating (DC): 150V; Features: Automotive AEC-Q200; Length: 2mm; Height: 0.6mm; Width: 0.049inch; Depth: 1.25mm; Radiation Hardening: No; Lead Free: Lead Free; REACH SVHC: No SVHC; ComponentLink1URL: https://datasheet.ciiva.com/11821/0900766b80f80784-11821543.pdf?src-supplier=RSComponents; ComponentLink1Description: https://datasheet.ciiva.com/11821/0900766b80f80784-11821543.pdf?src-supplier=RSComponents; ComponentLink2URL: https://datasheet.ciiva.com/7802/426256-7802438.pdf?src-supplier=Element14; ComponentLink2Description: https://datasheet.ciiva.com/7802/426256-7802438.pdf?src-supplier=Element14; ComponentLink3URL: https://datasheet.ciiva.com/16775/70260748-16775350.pdf?src-supplier=Allied+Electronics; ComponentLink3Description: https://datasheet.ciiva.com/16775/70260748-16775350.pdf?src-supplier=Allied+Electronics; ComponentLink4URL: https://datasheet.ciiva.com/9198/aoa0000ce2-9198663.pdf?src-supplier=Avnet; ComponentLink4Description: https://datasheet.ciiva.com/9198/aoa0000ce2-9198663.pdf?src-supplier=Avnet; ComponentLink5URL: https://datasheet.ciiva.com/22687/1678782-22687448.pdf?src-supplier=Element14; ComponentLink5Description: https://datasheet.ciiva.com/22687/1678782-22687448.pdf?src-supplier=Element14; ComponentLink6URL: https://datasheet.ciiva.com/46372/1678782-46372712.pdf?src-supplier=Element14; ComponentLink6Description: https://datasheet.ciiva.com/46372/1678782-46372712.pdf?src-supplier=Element14; ComponentLink7URL: https://datasheet.ciiva.com/46372/1678782-46372713.pdf?src-supplier=Element14; ComponentLink7Description: https://datasheet.ciiva.com/46372/1678782-46372713.pdf?src-supplier=Element14; ComponentLink8URL: https://datasheet.ciiva.com/22667/1678782-22667898.pdf?src-supplier=Element14; ComponentLink8Description: https://datasheet.ciiva.com/22667/1678782-22667898.pdf?src-supplier=Element14; ComponentLink9URL: https://datasheet.ciiva.com/17215/aoa0000ce2-17215019.pdf?src-supplier=Avnet+Europe; ComponentLink9Description: https://datasheet.ciiva.com/17215/aoa0000ce2-17215019.pdf?src-supplier=Avnet+Europe; ComponentLink10URL: https://datasheet.ciiva.com/6138/426256-6138188.pdf?src-supplier=Farnell; ComponentLink10Description: https://datasheet.ciiva.com/6138/426256-6138188.pdf?src-supplier=Farnell; ComponentLink11URL: https://datasheet.ciiva.com/24069/aoa0000ce2-24069708.pdf?src-supplier=Mouser; ComponentLink11Description: https://datasheet.ciiva.com/24069/aoa0000ce2-24069708.pdf?src-supplier=Mouser; ComponentLink12URL: https://datasheet.ciiva.com/30129/aoa0000ce2-30129052.pdf?src-supplier=Onlinecomponents.com; ComponentLink12Description: https://datasheet.ciiva.com/30129/aoa0000ce2-30129052.pdf?src-supplier=Onlinecomponents.com; ComponentLink13URL: https://datasheet.ciiva.com/16773/70260748-16773646.pdf?src-supplier=Allied+Electronics; ComponentLink13Description: https://datasheet.ciiva.com/16773/70260748-16773646.pdf?src-supplier=Allied+Electronics
S1 = B3F-1005: Switch Tactile N.O. SPST Flat Plunger PC Pins 0.05A 24VDC 2.55N Thru-Hole Bag; Manufacturer: Omron; Mechanical Life: 100000Cycles; Max Voltage Rating (DC): 24V; Switch Travel: 0.25mm; Contact Resistance: 100mR; Illumination Type: Non-Illuminated,Illuminated; Actuator Type: Standard; Switch Function: Off-Mom; Current Rating: 50mA; Electrical Life: 300000Cycles; Number of Poles: 1; Actuator Length: 0.9mm; Supplier 1: Digi-Key; Manufacturer Part Number: B3F-1005; RoHS: Yes; Category: Switch Accessories; Stock 1: 3042; Pricing 1: 1=0,33000, 10=0,31400, 25=0,29800, 100=0,26990, 250=0,24608, 500=0,22872, 1000=0,19512, 2500=0,18970, 5000=0,17886 (USD); Mount: Through Hole; Weight: 0.25g; Contact Plating: Silver,Gold; Contact Material: Gold,Silver; Min Operating Temperature: -25°C; Max Operating Temperature: 70°C; Operating Force: 2.55N; Throw Configuration: SPST; Packaging: Bag; Termination: PC Pins; Orientation: Straight; Package Quantity: 1500; Voltage Rating (DC): 24V; Max Current Rating: 50mA; Contact Current Rating: 50mA; Length: 6mm; Height: 4.3mm; Width: 6mm; Depth: 6mm; REACH SVHC: Unknown; Lead Free: Lead Free; ComponentLink1URL: https://datasheet.ciiva.com/1532/611570-1532565.pdf?src-supplier=Element14; ComponentLink1Description: https://datasheet.ciiva.com/1532/611570-1532565.pdf?src-supplier=Element14; ComponentLink2URL: https://datasheet.ciiva.com/48509/b3f-48509461.pdf?src-supplier=Distrelec; ComponentLink2Description: https://datasheet.ciiva.com/48509/b3f-48509461.pdf?src-supplier=Distrelec; ComponentLink3URL: https://datasheet.ciiva.com/2899/b3f-0811-2899831.pdf?src-supplier=Digi-Key; ComponentLink3Description: https://datasheet.ciiva.com/2899/b3f-0811-2899831.pdf?src-supplier=Digi-Key; ComponentLink4URL: https://datasheet.ciiva.com/7986/en-b3f-7986906.pdf?src-supplier=Element14; ComponentLink4Description: https://datasheet.ciiva.com/7986/en-b3f-7986906.pdf?src-supplier=Element14; ComponentLink5URL: https://datasheet.ciiva.com/16154/en-b3f-16154890.pdf?src-supplier=Onlinecomponents.com; ComponentLink5Description: https://datasheet.ciiva.com/16154/en-b3f-16154890.pdf?src-supplier=Onlinecomponents.com
T1 = MMBT3906-7-F: TRANS PNP 40V 0.2A SOT23-3; Manufacturer: Diodes Zetex; Max Collector Current: 200mA; Max Power Dissipation: 300mW; Transition Frequency: 250MHz; Emitter Base Voltage (VEBO): 6V; Collector Emitter Saturation Voltage: -400mV; Element Configuration: Single; Continuous Collector Current: -200mA; Voltage Rating (DC): -40V; hFE Min: 100; Number of Elements: 1; Supplier 1: Digi-Key; Manufacturer Part Number: MMBT3906-7-F; RoHS: Yes; Category: BJTs; Stock 1: 42541; Pricing 1: 1=0,12000, 10=0,10600, 25=0,10120, 100=0,04440, 250=0,04268, 500=0,03490, 1000=0,02424 (USD); Mount: Surface Mount; Case/Package: SOT-23; Number of Pins: 3; Weight: 0.000282oz; Contact Plating: Tin,Matte; Min Operating Temperature: -55°C; Max Operating Temperature: 150°C; Polarity: PNP; Collector Emitter Voltage (VCEO): 40V; Collector Emitter Breakdown Voltage: 40V; Max Breakdown Voltage: 40V; Collector Base Voltage (VCBO): 40V; Power Dissipation: 300mW; Max Frequency: 250MHz; Gain Bandwidth Product: 250MHz; Current Rating: -200mA; Packaging: Tape and Reel; Package Quantity: 3000; Frequency: 250MHz; Length: 3.05mm; Height: 1mm; Width: 1.4mm; Radiation Hardening: No; REACH SVHC: No SVHC; Lead Free: Lead Free; ComponentLink1URL: https://datasheet.ciiva.com/27052/1540746-27052408.pdf?src-supplier=Jameco; ComponentLink1Description: https://datasheet.ciiva.com/27052/1540746-27052408.pdf?src-supplier=Jameco; ComponentLink2URL: https://datasheet.ciiva.com/15139/getdatasheetpartid-255292-15139821.pdf?src-supplier=Verical; ComponentLink2Description: https://datasheet.ciiva.com/15139/getdatasheetpartid-255292-15139821.pdf?src-supplier=Verical
U1 = MC34063EBD-TR: Conv DC-DC Step Down/Step Up 3V to 40V 8-Pin SO N T/R; Manufacturer: STMicroelectronics; Number of Outputs: 1; Switching Frequency: 100kHz; Synchronous Rectifier: No; Min Output Voltage: 1.25V; Max Output Voltage: 38V; Output Type: Adjustable,Fixed; Efficiency: 89%; Output Current: 1.5A; Supplier 1: Digi-Key; Manufacturer Part Number: MC34063EBD-TR; RoHS: Yes; Category: Voltage Regulators - Switching; Stock 1: 77713; Pricing 1: 1=0,66000, 10=0,56100, 25=0,52360, 100=0,38900, 250=0,32912, 500=0,31416, 1000=0,23188 (USD); Mount: Surface Mount; Case/Package: SO; Number of Pins: 8; Contact Plating: Gold; Min Operating Temperature: -40°C; Max Operating Temperature: 125°C; Min Input Voltage: 3V; Output Voltage: 38V; Packaging: Tape and Reel; Max Input Voltage: 40V; Package Quantity: 1; Max Output Current: 1.5A; Length: 5mm; Height: 1.65mm; Width: 4mm; Radiation Hardening: No; REACH SVHC: No SVHC; Lead Free: Lead Free; ComponentLink1URL: https://datasheet.ciiva.com/4878/cd00001232-4878840.pdf?src-supplier=Mouser; ComponentLink1Description: https://datasheet.ciiva.com/4878/cd00001232-4878840.pdf?src-supplier=Mouser; ComponentLink2URL: https://datasheet.ciiva.com/2029/cd00001232-2029723.pdf?src-supplier=Digi-Key; ComponentLink2Description: https://datasheet.ciiva.com/2029/cd00001232-2029723.pdf?src-supplier=Digi-Key; ComponentLink3URL: https://datasheet.ciiva.com/17297/cd00001232-17297035.pdf?src-supplier=Avnet+Europe; ComponentLink3Description: https://datasheet.ciiva.com/17297/cd00001232-17297035.pdf?src-supplier=Avnet+Europe; ComponentLink4URL: https://datasheet.ciiva.com/2029/cd00001232-2029724.pdf?src-supplier=Digi-Key; ComponentLink4Description: https://datasheet.ciiva.com/2029/cd00001232-2029724.pdf?src-supplier=Digi-Key; ComponentLink5URL: https://datasheet.ciiva.com/16209/cd00001232-16209900.pdf?src-supplier=Future+Electronics; ComponentLink5Description: https://datasheet.ciiva.com/16209/cd00001232-16209900.pdf?src-supplier=Future+Electronics; ComponentLink6URL: https://datasheet.ciiva.com/2029/cd00001232-2029725.pdf?src-supplier=Digi-Key; ComponentLink6Description: https://datasheet.ciiva.com/2029/cd00001232-2029725.pdf?src-supplier=Digi-Key